# EAGLE schematic SX-150 Mk II (MIDI THT Proto E7) (EAGLE 7.4.0)
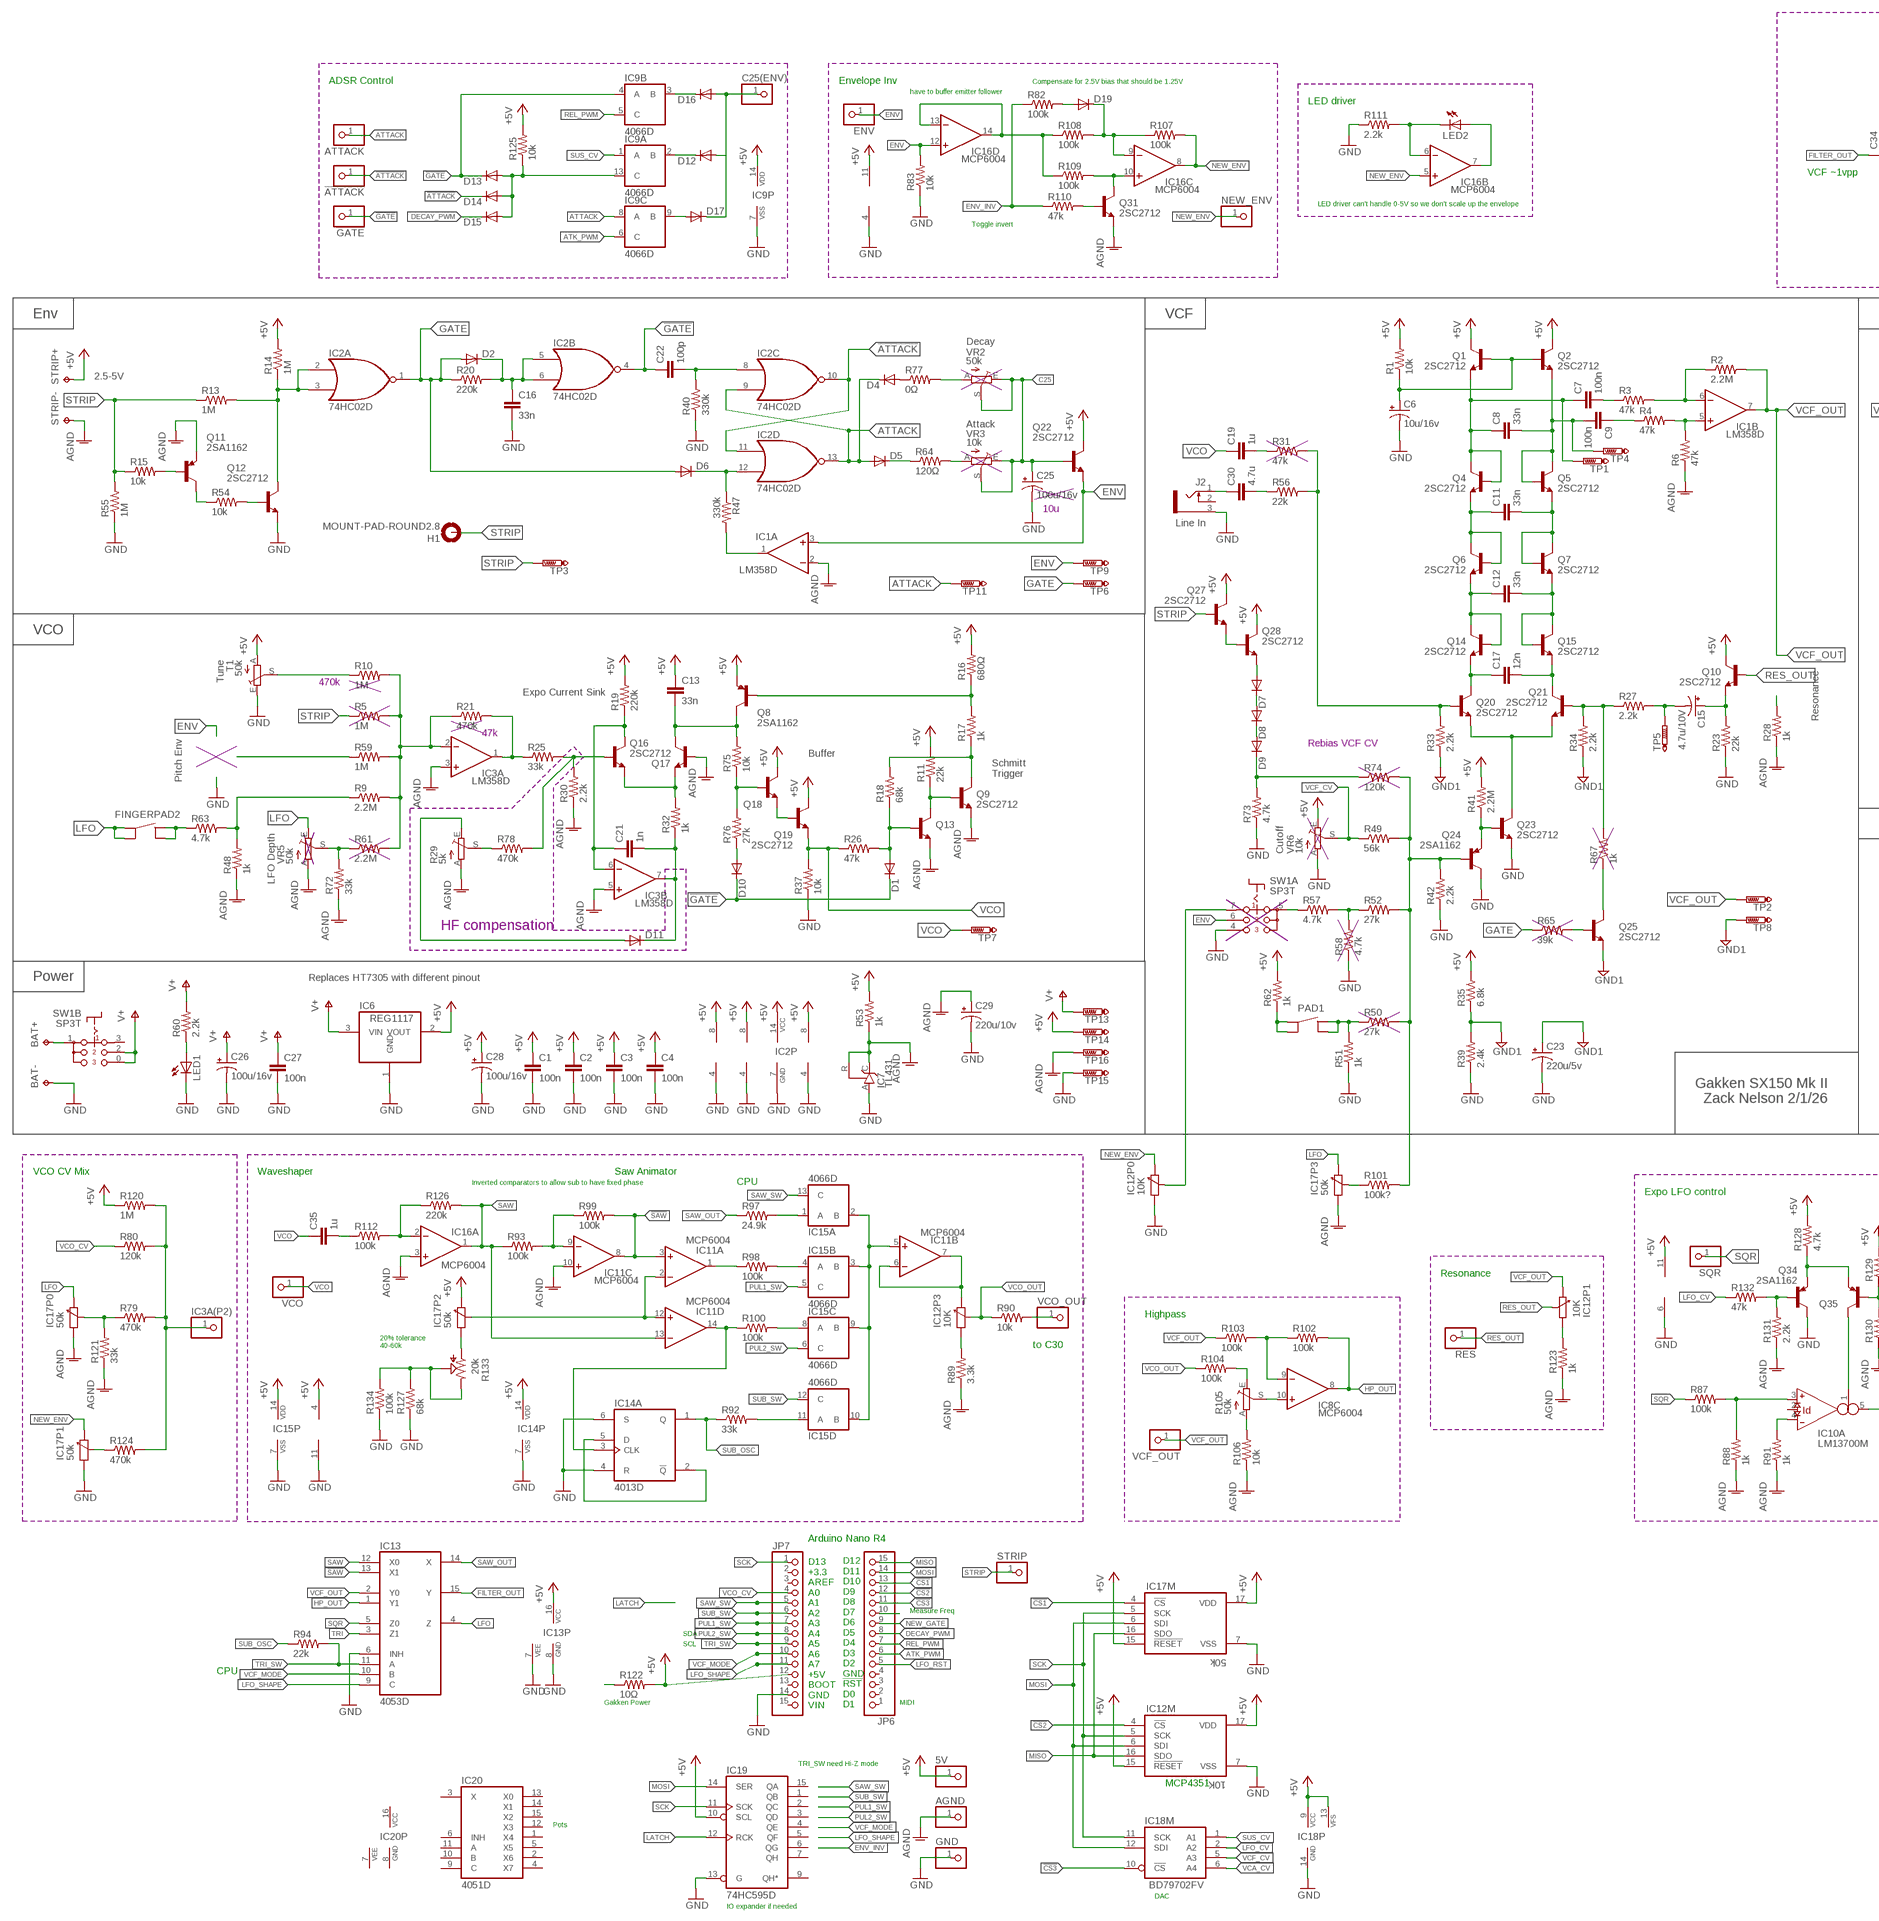
[diagram p0: schematic, sheet 1, part 1 of 2]
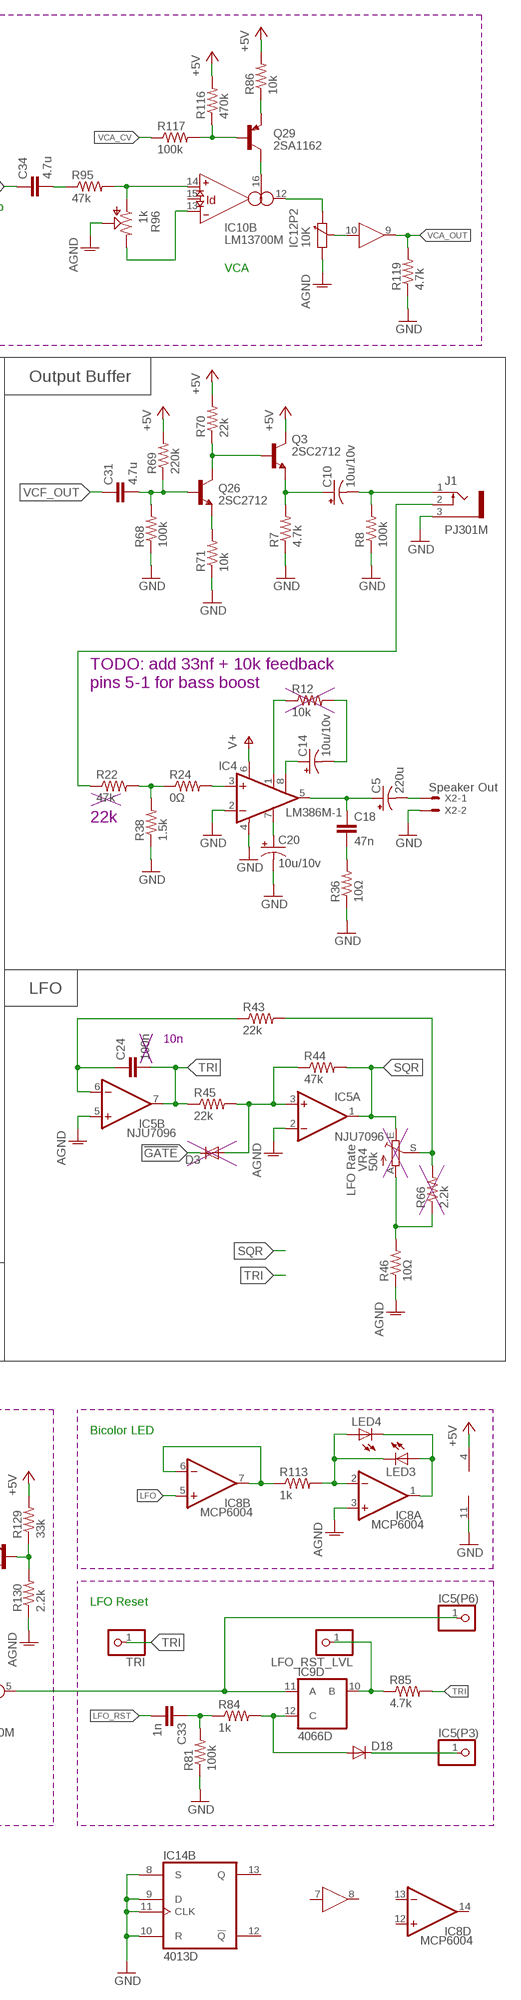
[diagram p1: schematic, sheet 1, part 2 of 2]

## Parts
5V  PINHD-1X1  [1X01]
!ATTACK  PINHD-1X1  [1X01]
!GATE  PINHD-1X1  [1X01]
AGND  PINHD-1X1  [1X01]
ATTACK  PINHD-1X1  [1X01]
BAT+  TPPAD1-13  [P1-13]
BAT-  TPPAD1-13  [P1-13]
C1  100n  C-EUC0603  [C0603]
C2  100n  C-EUC0603  [C0603]
C3  100n  C-EUC0603  [C0603]
C4  100n  C-EUC0603  [C0603]
C5  220u  CPOL-USE2.5-6  [E2,5-6]
C6  10u/16v  CPOL-USE2.5-6  [E2,5-6]
C7  100n  C-EUC0603  [C0603]
C8  33n  C-EUC0603  [C0603]
C9  100n  C-EUC0603  [C0603]
C10  10u/10v  CPOL-USE2.5-6  [E2,5-6]
C11  33n  C-EUC0603  [C0603]
C12  33n  C-EUC0603  [C0603]
C13  33n  C-EUC0603  [C0603]
C14  10u/10v  CPOL-USE2.5-6  [E2,5-6]
C15  4.7u/10V  CPOL-USE2.5-6  [E2,5-6]
C16  33n  C-EUC0603  [C0603]
C17  12n  C-EUC0603  [C0603]
C18  47n  C-EUC0603  [C0603]
C19  1u  C-EUC0603  [C0603]
C20  10u/10v  CPOL-USE2.5-6  [E2,5-6]
C21  1n  C-EUC0603  [C0603]
C22  100p  C-EUC0603  [C0603]
C23  220u/5v  CPOL-USE2.5-6  [E2,5-6]
C24  100n  C-EUC0603  [C0603]
C25  100u/16v  CPOL-USE2.5-6  [E2,5-6]
C25(ENV)  PINHD-1X1  [1X01]
C26  100u/16v  CPOL-USE2.5-6  [E2,5-6]
C27  100n  C-EUC0603  [C0603]
C28  100u/16v  CPOL-USE2.5-6  [E2,5-6]
C29  220u/10v  CPOL-USE2.5-6  [E2,5-6]
C30  4.7u  C-EUC0603  [C0603]
C31  4.7u  C-EUC0603  [C0603]
C33  1n  C-EUC0603  [C0603]
C34  4.7u  C-EUC0603  [C0603]
C35  1u  C-EUC0603  [C0603]
D1  DIODE-DO41-7.6  [DO41-7.6]
D2  DIODE-MINIMELF  [MINIMELF]
D3  DIODE-MINIMELF  [MINIMELF]
D4  DIODE-MINIMELF  [MINIMELF]
D5  DIODE-MINIMELF  [MINIMELF]
D6  DIODE-MINIMELF  [MINIMELF]
D7  DIODE-MINIMELF  [MINIMELF]
D8  DIODE-MINIMELF  [MINIMELF]
D9  DIODE-MINIMELF  [MINIMELF]
D10  DIODE-DO41-7.6  [DO41-7.6]
D11  DIODE-DO41-7.6  [DO41-7.6]
D12  DIODE-MINIMELF  [MINIMELF]
D13  DIODE-MINIMELF  [MINIMELF]
D14  DIODE-MINIMELF  [MINIMELF]
D15  DIODE-MINIMELF  [MINIMELF]
D16  DIODE-MINIMELF  [MINIMELF]
D17  DIODE-MINIMELF  [MINIMELF]
D18  DIODE-MINIMELF  [MINIMELF]
D19  DIODE-MINIMELF  [MINIMELF]
ENV  PINHD-1X1  [1X01]
FINGERPAD2  GAKKEN-PAD  [GAKKEN-PAD]
GND  PINHD-1X1  [1X01]
H1  MOUNT-PAD-ROUND2.8  [2,8-PAD]
IC1  LM358D  [SO08]
IC2  74HC02D  7402D  [SO14]
IC3  LM358D  [SO08]
IC3A(P2)  PINHD-1X1  [1X01]
IC4  LM386M-1  [SO08]
IC5  NJU7096  LM358D  [SO08]
IC5(P3)  PINHD-1X1  [1X01]
IC5(P6)  PINHD-1X1  [1X01]
IC6  REG1117  [SOT223]
IC7  TL431  TL431CLP  [TO92-CLP]
IC8  MCP6004  MCP604SL  [SO14]
IC9  4066D  [SO14]
IC10  LM13700M  [SO16]
IC11  MCP6004  MCP604SL  [SO14]
IC12  10K  MCP4351-103E/ST  [TSSOP20_MC_MCH]
IC13  4053D  [SO16]
IC14  4013D  [SO14]
IC15  4066D  [SO14]
IC16  MCP6004  MCP604SL  [SO14]
IC17  50k  MCP4351-103E/ST  [TSSOP20_MC_MCH]
IC18  BD79702FV  [TSSOP14]
IC19  74HC595D  [SO16]
IC20  4051D  [SO16]
J1  PJ301M  WQP_PJ301M-12_JACK  [JACK-3.5-NOHOLE]
J2  Line In  WQP_PJ301M-12_JACK  [JACK-3.5-NOHOLE]
JP6  PINHD-1X15  [1X15]
JP7  PINHD-1X15  [1X15]
LED1  LED3MM  [LED3MM]
LED2  LED3MM  [LED3MM]
LED3  LED3MM  [LED3MM]
LED4  LED3MM  [LED3MM]
LFO_RST_LVL  PINHD-1X1  [1X01]
NEW_ENV  PINHD-1X1  [1X01]
PAD1  GAKKEN-PAD  [GAKKEN-PAD]
Q1  2SC2712  BC808-NPN-SOT23-BEC  [SOT23-BEC]
Q2  2SC2712  BC808-NPN-SOT23-BEC  [SOT23-BEC]
Q3  2SC2712  BC808-NPN-SOT23-BEC  [SOT23-BEC]
Q4  2SC2712  BC808-NPN-SOT23-BEC  [SOT23-BEC]
Q5  2SC2712  BC808-NPN-SOT23-BEC  [SOT23-BEC]
Q6  2SC2712  BC808-NPN-SOT23-BEC  [SOT23-BEC]
Q7  2SC2712  BC808-NPN-SOT23-BEC  [SOT23-BEC]
Q8  2SA1162  BC807-16-PNP-SOT23-BEC  [SOT23-BEC]
Q9  2SC2712  BC808-NPN-SOT23-BEC  [SOT23-BEC]
Q10  2SC2712  BC808-NPN-SOT23-BEC  [SOT23-BEC]
Q11  2SA1162  BC807-16-PNP-SOT23-BEC  [SOT23-BEC]
Q12  2SC2712  BC808-NPN-SOT23-BEC  [SOT23-BEC]
Q13  2SC2712  BC808-NPN-SOT23-BEC  [SOT23-BEC]
Q14  2SC2712  BC808-NPN-SOT23-BEC  [SOT23-BEC]
Q15  2SC2712  BC808-NPN-SOT23-BEC  [SOT23-BEC]
Q16  2SC2712  BC808-NPN-SOT23-BEC  [SOT23-BEC]
Q17  2SC2712  BC808-NPN-SOT23-BEC  [SOT23-BEC]
Q18  2SC2712  BC808-NPN-SOT23-BEC  [SOT23-BEC]
Q19  2SC2712  BC808-NPN-SOT23-BEC  [SOT23-BEC]
Q20  2SC2712  BC808-NPN-SOT23-BEC  [SOT23-BEC]
Q21  2SC2712  BC808-NPN-SOT23-BEC  [SOT23-BEC]
Q22  2SC2712  BC808-NPN-SOT23-BEC  [SOT23-BEC]
Q23  2SC2712  BC808-NPN-SOT23-BEC  [SOT23-BEC]
Q24  2SA1162  BC807-16-PNP-SOT23-BEC  [SOT23-BEC]
Q25  2SC2712  BC808-NPN-SOT23-BEC  [SOT23-BEC]
Q26  2SC2712  BC808-NPN-SOT23-BEC  [SOT23-BEC]
Q27  2SC2712  BC808-NPN-SOT23-BEC  [SOT23-BEC]
Q28  2SC2712  BC808-NPN-SOT23-BEC  [SOT23-BEC]
Q29  2SA1162  BC807-16-PNP-SOT23-BEC  [SOT23-BEC]
Q31  2SC2712  BC808-NPN-SOT23-BEC  [SOT23-BEC]
Q34  2SA1162  BC807-16-PNP-SOT23-BEC  [SOT23-BEC]
Q35  2SA1162  BC807-16-PNP-SOT23-BEC  [SOT23-BEC]
R1  10k  R-US_R0603  [R0603]
R2  2.2M  R-US_R0603  [R0603]
R3  47k  R-US_R0603  [R0603]
R4  47k  R-US_R0603  [R0603]
R5  1M  R-US_R0603  [R0603]
R6  47k  R-US_R0603  [R0603]
R7  4.7k  R-US_R0603  [R0603]
R8  100k  R-US_R0603  [R0603]
R9  2.2M  R-US_R0603  [R0603]
R10  1M  R-US_R0603  [R0603]
R11  22k  R-US_R0603  [R0603]
R12  10k  R-US_R0603  [R0603]
R13  1M  R-US_R0603  [R0603]
R14  1M  R-US_R0603  [R0603]
R15  10k  R-US_R0603  [R0603]
R16  680Ω  R-US_R0603  [R0603]
R17  1k  R-US_R0603  [R0603]
R18  68k  R-US_R0603  [R0603]
R19  220k  R-US_R0603  [R0603]
R20  220k  R-US_R0603  [R0603]
R21  470k  R-US_R0603  [R0603]
R22  47k  R-US_R0603  [R0603]
R23  22k  R-US_R0603  [R0603]
R24  0Ω  R-US_R0603  [R0603]
R25  33k  R-US_R0603  [R0603]
R26  47k  R-US_R0603  [R0603]
R27  2.2k  R-US_R0603  [R0603]
R28  1k  R-US_R0603  [R0603]
R29  5k  TRIM_EU-B25P  [B25P]
R30  2.2k  R-US_R0603  [R0603]
R31  47k  R-US_R0603  [R0603]
R32  1k  R-US_R0603  [R0603]
R33  2.2k  R-US_R0603  [R0603]
R34  2.2k  R-US_R0603  [R0603]
R35  6.8k  R-US_R0603  [R0603]
R36  10Ω  R-US_R0603  [R0603]
R37  10k  R-US_R0603  [R0603]
R38  1.5k  R-US_R0603  [R0603]
R39  2.4k  R-US_R0603  [R0603]
R40  330k  R-US_R0603  [R0603]
R41  2.2M  R-US_R0603  [R0603]
R42  2.2k  R-US_R0603  [R0603]
R43  22k  R-US_R0603  [R0603]
R44  47k  R-US_R0603  [R0603]
R45  22k  R-US_R0603  [R0603]
R46  10Ω  R-US_R0603  [R0603]
R47  330k  R-US_R0603  [R0603]
R48  1k  R-US_R0603  [R0603]
R49  56k  R-US_R0603  [R0603]
R50  27k  R-US_R0603  [R0603]
R51  1k  R-US_R0603  [R0603]
R52  27k  R-US_R0603  [R0603]
R53  1k  R-US_R0603  [R0603]
R54  10k  R-US_R0603  [R0603]
R55  1M  R-US_R0603  [R0603]
R56  22k  R-US_R0603  [R0603]
R57  4.7k  R-US_R0603  [R0603]
R58  4.7k  R-US_R0603  [R0603]
R59  1M  R-US_R0603  [R0603]
R60  2.2k  R-US_R0603  [R0603]
R61  2.2M  R-US_R0603  [R0603]
R62  1k  R-US_R0603  [R0603]
R63  4.7k  R-US_R0603  [R0603]
R64  120Ω  R-US_R0603  [R0603]
R65  39k  R-US_R0603  [R0603]
R66  2.2k  R-US_R0603  [R0603]
R67  1k  R-US_R0603  [R0603]
R68  100k  R-US_R0603  [R0603]
R69  220k  R-US_R0603  [R0603]
R70  22k  R-US_R0603  [R0603]
R71  10k  R-US_R0603  [R0603]
R72  33k  R-US_R0603  [R0603]
R73  4.7k  R-US_R0603  [R0603]
R74  120k  R-US_R0603  [R0603]
R75  10k  R-US_R0603  [R0603]
R76  27k  R-US_R0603  [R0603]
R77  0Ω  R-US_R0603  [R0603]
R78  470k  R-US_R0603  [R0603]
R79  470k  R-US_R0603  [R0603]
R80  120k  R-US_R0603  [R0603]
R81  100k  R-US_R0603  [R0603]
R82  100k  R-US_R0603  [R0603]
R83  10k  R-US_R0603  [R0603]
R84  1k  R-US_R0603  [R0603]
R85  4.7k  R-US_R0603  [R0603]
R86  10k  R-US_R0603  [R0603]
R87  100k  R-US_R0603  [R0603]
R88  1k  R-US_R0603  [R0603]
R89  3.3k  R-US_R0603  [R0603]
R90  10k  R-US_R0603  [R0603]
R91  1k  R-US_R0603  [R0603]
R92  33k  R-US_R0603  [R0603]
R93  100k  R-US_R0603  [R0603]
R94  22k  R-US_R0603  [R0603]
R95  47k  R-US_R0603  [R0603]
R96  1k  TRIM_US-B25P  [B25P]
R97  24.9k  R-US_R0603  [R0603]
R98  100k  R-US_R0603  [R0603]
R99  100k  R-US_R0603  [R0603]
R100  100k  R-US_R0603  [R0603]
R101  100k?  R-US_R0603  [R0603]
R102  100k  R-US_R0603  [R0603]
R103  100k  R-US_R0603  [R0603]
R104  100k  R-US_R0603  [R0603]
R105  50k  TRIM_EU-B25P  [B25P]
R106  10k  R-US_R0603  [R0603]
R107  100k  R-US_R0603  [R0603]
R108  100k  R-US_R0603  [R0603]
R109  100k  R-US_R0603  [R0603]
R110  47k  R-US_R0603  [R0603]
R111  2.2k  R-US_R0603  [R0603]
R112  100k  R-US_R0603  [R0603]
R113  1k  R-US_R0603  [R0603]
R116  470k  R-US_R0603  [R0603]
R117  100k  R-US_R0603  [R0603]
R119  4.7k  R-US_R0603  [R0603]
R120  1M  R-US_R0603  [R0603]
R121  33k  R-US_R0603  [R0603]
R122  10Ω  R-US_R0603  [R0603]
R123  1k  R-US_R0603  [R0603]
R124  470k  R-US_R0603  [R0603]
R125  10k  R-US_R0603  [R0603]
R126  220k  R-US_R0603  [R0603]
R127  68k  R-US_R0603  [R0603]
R128  4.7k  R-US_R0603  [R0603]
R129  33k  R-US_R0603  [R0603]
R130  2.2k  R-US_R0603  [R0603]
R131  2.2k  R-US_R0603  [R0603]
R132  47k  R-US_R0603  [R0603]
R133  20k  TRIM_US-B25P  [B25P]
R134  100k  R-US_R0603  [R0603]
RES  PINHD-1X1  [1X01]
SQR  PINHD-1X1  [1X01]
STRIP  PINHD-1X1  [1X01]
STRIP+  TPB2,54  [B2,54]
STRIP-  TPB2,54  [B2,54]
SW1  SP3T  [SP3T]
T1  50k  TRIM_EU-CA9V  [CA9V]
TP1  PTR1B1,27  [B1,27]
TP2  PTR1B1,27  [B1,27]
TP3  PTR1B1,27  [B1,27]
TP4  PTR1B1,27  [B1,27]
TP5  PTR1B1,27  [B1,27]
TP6  PTR1B1,27  [B1,27]
TP7  PTR1B1,27  [B1,27]
TP8  PTR1B1,27  [B1,27]
TP9  PTR1B1,27  [B1,27]
TP11  PTR1B1,27  [B1,27]
TP13  PTR1B1,27  [B1,27]
TP14  PTR1B1,27  [B1,27]
TP15  PTR1B1,27  [B1,27]
TP16  PTR1B1,27  [B1,27]
TRI  PINHD-1X1  [1X01]
VCF_OUT  PINHD-1X1  [1X01]
VCO  PINHD-1X1  [1X01]
VCO_OUT  PINHD-1X1  [1X01]
VR2  50k  TRIM_EU-CA9V  [CA9V]
VR3  10k  TRIM_EU-CA9V  [CA9V]
VR4  50k  TRIM_EU-CA9V  [CA9V]
VR5  50k  TRIM_EU-CA9V  [CA9V]
VR6  10k  TRIM_EU-CA9V  [CA9V]
X2  Speaker Out  22-23-2021  [22-23-2021]

## Nets
!ATTACK: !ATTACK.1 D14.C IC2.10(C:O) IC2.11(D:I0)
!CS1 [power]: IC17.4(M:!CS) JP6.13
!CS2 [power]: IC12.4(M:!CS) JP6.12
!CS3: IC18.10(M:!CS) JP6.11
!GATE: !GATE.1 C22.1 D1.C D3.C D10.C D13.C IC2.4(B:O) IC9.4(B:A)
!SAW: IC11.3(A:+IN) IC11.8(C:OUT) IC13.13(X1) R99.2
+5V [power]: 5V.1 C1.1 C2.1 C3.1 C4.1 C13.1 C28.+ IC1.8(P:V+) IC2.14(P:VCC) IC3.8(P:V+) IC5.8(P:V+) IC6.2(VOUT) IC8.4(P:V+) IC9.14(P:VDD) IC10.11(V+) IC11.4(P:V+) IC12.15(M:!RESET) IC12.17(M:VDD) IC13.16(VCC) IC14.14(P:VDD) IC15.14(P:VDD) IC16.11(P:V-) IC17.15(M:!RESET) IC17.17(M:VDD) IC17.18(P2:B) IC18.9(P:VCC) IC18.13(P:VFS) IC19.10(SCL) JP7.12 Q1.C Q2.C Q3.C Q8.E Q10.C Q18.C Q19.C Q22.C Q27.C Q28.C R1.2 R11.2 R14.2 R16.2 R19.2 R35.2 R41.2 R53.2 R62.2 R69.2 R70.2 R86.2 R116.2 R120.1 R122.2 R125.2 R128.2 R129.2 STRIP+.TP T1.A TP14.TP VR6.E
AGND [power]: AGND.1 C29.+ IC1.2(A:-IN) IC3.3(A:+IN) IC3.5(B:+IN) IC5.2(A:-IN) IC5.5(B:+IN) IC7.C IC7.R IC8.3(A:+IN) IC11.10(C:+IN) IC12.20(P2:A) IC16.3(A:+IN) IC17.1(P3:A) IC17.11(P0:A) Q9.E Q11.E Q13.E Q17.B Q31.E R6.1 R28.1 R29.A R30.1 R46.1 R48.1 R53.1 R72.1 R88.1 R89.1 R91.1 R96.S R106.1 R121.1 R123.1 R130.1 R131.1 STRIP-.TP TP16.TP VR5.A
ATK_PWM: IC9.6(C:C) JP6.6
ATTACK: ATTACK.1 D4.C D5.A IC2.9(C:I1) IC2.13(D:O) IC9.8(C:A) TP11.TP
C25: C25(ENV).1 C25.+ D12.A D16.A D17.C Q22.B VR2.E VR2.S VR3.E VR3.S
DECAY_PWM: D15.C JP6.8
ENV: ENV.1 IC1.3(A:+IN) IC16.12(D:+IN) Q22.E R83.2 SW1.6(A:T2) TP9.TP
ENV_INV: R82.1 R110.1
FILTER_OUT: C34.1 IC13.15(Y)
GATE: D2.A D6.A IC2.1(A:O) R20.1 R65.1 TP6.TP
GND: BAT-.TP C1.2 C2.2 C3.2 C4.2 C6.- C16.2 C20.- C23.- C25.- C26.- C27.2 C28.- C29.- GND.1 IC1.4(P:V-) IC2.7(P:GND) IC3.4(P:V-) IC4.2(-IN) IC4.4(GND) IC5.4(P:V-) IC6.1(GND) IC7.A IC8.11(P:V-) IC9.7(P:VSS) IC10.6(V-) IC11.11(P:V-) IC12.7(M:VSS) IC12.11(P0:A) IC13.6(INH) IC13.7(VEE) IC13.8(GND) IC14.4(A:R) IC14.6(A:S) IC14.7(P:VSS) IC14.8(B:S) IC14.9(B:D) IC14.10(B:R) IC14.11(B:CLK) IC15.7(P:VSS) IC16.4(P:V+) IC17.7(M:VSS) IC17.10(P1:A) IC18.14(P:GND) IC19.13(G) J1.3 J2.3 JP7.14 LED1.K(C) Q12.E Q23.E Q24.C Q34.C R7.1 R8.1 R23.1 R36.1 R37.1 R38.1 R39.1 R40.1 R42.1 R51.1 R55.1 R58.1 R68.1 R71.1 R73.1 R81.1 R83.1 R111.1 R119.1 R127.1 R134.1 SW1.4(A:T3) T1.E TP15.TP VR6.A X2.2
GND1: C23.+ Q25.E R33.1 R34.1 R35.1 R39.2 TP8.TP
HP_OUT: IC8.8(C:OUT) IC13.1(Y1) R102.2
LATCH: IC19.12(RCK)
LFO: FINGERPAD2.A0 FINGERPAD2.A1 IC8.5(B:+IN) IC13.4(Z) IC17.3(P3:B) IC17.13(P0:B) VR5.E
LFO_CV: IC18.2(M:A2) R132.1
LFO_RST: C33.2 JP6.5
LFO_SHAPE: IC13.9(C) JP7.11
MISO [power]: IC12.16(M:SDO) IC17.16(M:SDO) JP6.15
MOSI [power]: IC12.6(M:SDI) IC17.6(M:SDI) IC18.12(M:SDI) IC19.14(SER) JP6.14
N$1: IC1.1(A:OUT) R47.2
N$2: D5.C R64.1
N$3: IC2.2(A:I0) IC2.3(A:I1) Q12.C R13.2 R14.1
N$4: D12.C IC9.2(A:B)
N$5: JP6.10
N$6: C22.2 IC2.8(C:I0) R40.2
N$7: Q12.B R54.2
N$8: C16.1 D2.C IC2.5(B:I0) IC2.6(B:I1) R20.2
N$9: D6.C IC2.12(D:I1) R47.1
N$10: D4.A R77.1
N$11: D17.A IC9.9(C:B)
N$12: R64.2 VR3.A
N$13: D19.A R82.2
N$14: Q11.C R54.1
N$15: Q11.B R15.2
N$16: R61.1 R72.2 VR5.S
N$17: IC5(P6).1 IC9.11(D:A) IC10.5(A:OUT)
N$18: IC3.2(A:-IN) R5.2 R9.2 R10.2 R21.1 R59.2 R61.2
N$19: D18.C IC5(P3).1
N$20: R46.2 R66.1 VR4.A
N$21: R43.2 R66.2 VR4.S
N$22: IC3.1(A:OUT) R21.2 R25.1
N$23: Q16.B R25.2 R30.2 R78.2
N$24: R59.1
N$25: R9.1 R48.2 R63.2
N$26: R10.1 T1.S
N$27: C13.2 Q8.C Q17.C R75.2
N$28: Q8.B R16.1 R17.2
N$29: C21.2 D11.C IC3.7(B:OUT) R32.1
N$30: Q16.E Q17.E R32.2
N$31: C21.1 IC3.6(B:-IN) Q16.C R19.1
N$32: Q9.C R17.1 R18.2
N$33: Q18.B R75.1 R76.2
N$34: Q18.E Q19.B
N$35: BAT+.TP SW1.1(B:P1)
N$36: Q9.B Q13.C R11.1
N$37: D1.A Q13.B R18.1 R26.2
N$38: D10.A R76.1
N$39: C7.1 C8.1 Q1.E Q4.B Q4.C TP1.TP
N$40: C8.2 C9.2 Q2.E Q5.B Q5.C TP4.TP
N$41: C6.+ Q1.B Q2.B R1.1
N$42: Q20.E Q21.E Q23.C
N$43: C11.1 Q4.E Q6.B Q6.C
N$44: C11.2 Q5.E Q7.B Q7.C
N$45: Q20.B R31.2 R33.2 R56.2
N$46: C12.1 Q6.E Q14.B Q14.C
N$47: C12.2 Q7.E Q15.B Q15.C
N$48: C17.1 Q14.E Q20.C
N$49: C17.2 Q15.E Q21.C
N$50: Q21.B R27.1 R34.2 R67.2
N$51: C7.2 R3.1
N$52: C9.1 R4.1
N$53: IC1.6(B:-IN) R2.1 R3.2
N$54: IC1.5(B:+IN) R4.2 R6.2
N$55: Q23.B Q24.E R41.1
N$56: Q25.C R67.1
N$57: Q25.B R65.2
N$58: C15.- R27.2 TP5.TP
N$59: C15.+ Q10.E R23.2
N$60: IC17.9(P1:W) R124.1
N$61: R28.2
N$62: Q29.E R86.1
N$63: Q24.B R42.2 R49.2 R50.2 R52.2 R74.2 R101.2
N$64: R57.1 SW1.5(A:P1)
N$65: C35.2 R112.1
N$66: R52.1 R57.2 R58.2
N$67: PAD1.B0 PAD1.B1 R50.1 R51.2
N$68: C19.2 R31.1
N$69: C30.2 R56.1
N$70: C30.1 J2.1
N$71: C31.2 Q26.B R68.2 R69.1
N$72: Q3.B Q26.C R70.1
N$73: Q26.E R71.2
N$74: C10.+ Q3.E R7.2
N$75: C10.- J1.1 R8.2
N$76: Q27.E Q28.B
N$77: PAD1.A0 PAD1.A1 R62.1
N$78: D7.A Q28.E
N$79: D7.C D8.A
N$80: D8.C D9.A
N$81: D9.C R73.2 R74.1
N$82: FINGERPAD2.B0 FINGERPAD2.B1 R63.1
N$83: C20.+ IC4.7(BYPASS)
N$84: C14.+ IC4.8(GAIN)
N$85: IC4.1(GAIN) R12.1
N$86: C14.- R12.2
N$87: C5.+ C18.1 IC4.5(OUT)
N$88: IC4.3(+IN) R24.2
N$89: C5.- X2.1
N$90: J1.2 R22.1
N$91: C18.2 R36.2
N$92: D11.A R29.E
N$93: R22.2 R24.1 R38.2
N$94: LED1.A R60.1
N$95: IC10.16(B:IABC) Q29.C
N$96: R29.S R78.1
N$97: D13.A D14.A D15.A IC9.13(A:C) R125.1
N$98: C24.1 IC5.6(B:-IN) R43.1
N$100: D19.C IC16.9(C:-IN) R107.1 R108.2
N$101: D16.C IC9.3(B:B)
N$102: R77.2 VR2.A
N$103: D18.A IC9.12(D:C) R84.2
N$105: IC11.1(A:OUT) R98.1
N$106: IC8.10(C:+IN) R105.S
N$107: IC16.13(D:-IN) IC16.14(D:OUT) R108.1 R109.1
N$108: C33.1 R81.2 R84.1
N$109: IC14.2(A:!Q) IC14.5(A:D)
N$110: IC12.12(P0:W) SW1.7(A:T1)
N$111: IC10.3(A:+IN) R87.2 R88.2
N$112: IC10.4(A:-IN) R91.2
N$113: IC15.1(A:A) R97.2
N$114: IC15.4(B:A) R98.2
N$115: IC15.8(C:A) R100.2
N$116: IC10.14(B:+IN) R95.2 R96.A
N$117: IC12.1(P3:A) R89.2
N$118: IC9.10(D:B) LFO_RST_LVL.1 R85.1
N$119: IC11.5(B:+IN) IC15.2(A:B) IC15.3(B:B) IC15.9(C:B) IC15.10(D:B)
N$120: IC10.13(B:-IN) R96.E
N$121: IC15.11(D:A) R92.2
N$122: IC11.6(B:-IN) IC11.7(B:OUT) IC12.3(P3:B)
N$123: IC11.9(C:-IN) R93.2 R99.1
N$124: IC11.14(D:OUT) IC14.3(A:CLK) R100.1
N$125: C34.2 R95.1
N$126: IC8.9(C:-IN) R102.1 R103.2
N$127: Q29.B R116.1 R117.2
N$128: R104.2 R105.E
N$129: IC10.10(IN) IC12.19(P2:W)
N$130: R105.A R106.2
N$131: IC16.10(C:+IN) Q31.C R109.2
N$132: IC17.20(P2:A) R133.A
N$133: Q31.B R110.2
N$134: IC8.1(A:OUT) LED3.A LED4.K(C)
N$135: R127.2 R133.E R133.S R134.2
N$137: IC16.7(B:OUT) LED2.A
N$138: IC16.6(B:-IN) LED2.K(C) R111.2
N$139: IC8.2(A:-IN) LED3.K(C) LED4.A R113.2
N$140: IC8.6(B:-IN) IC8.7(B:OUT) R113.1
N$141: D3.A IC5.3(A:+IN) R44.1 R45.2
N$142: IC17.2(P3:W) R101.1
N$143 [power]: IC17.12(P0:W) R79.1 R121.2
N$144 [power]: IC3A(P2).1 R79.2 R80.2 R120.2 R124.2
N$145 [power]: IC10.12(B:OUT) IC12.18(P2:B)
N$150 [power]: R122.1
N$151: IC12.10(P1:A) R123.2
N$152: IC16.2(A:-IN) R112.2 R126.1
N$153: R90.2 VCO_OUT.1
N$155: Q34.E Q35.E R128.1
N$156: Q35.B R129.1 R130.2
N$157: Q34.B R131.2 R132.2
N$158: IC10.1(A:IABC) Q35.C
NEW_ENV: IC12.13(P0:B) IC16.5(B:+IN) IC16.8(C:OUT) IC17.8(P1:B) NEW_ENV.1 R107.2
NEW_GATE: JP6.9
PUL1_SW: IC15.5(B:C) JP7.7
PUL2_SW: IC15.6(C:C) JP7.8
REL_PWM: IC9.5(B:C) JP6.7
RES_OUT: IC12.9(P1:W) Q10.B RES.1
SAW: IC11.13(D:-IN) IC13.12(X0) IC16.1(A:OUT) R93.1 R126.2
SAW_CV: IC11.2(A:-IN) IC11.12(D:+IN) IC17.19(P2:W)
SAW_OUT: IC13.14(X) R97.1
SAW_SW: IC15.13(A:C) JP7.5
SCK [power]: IC12.5(M:SCK) IC17.5(M:SCK) IC18.11(M:SCK) IC19.11(SCK) JP7.1
SQR: IC5.1(A:OUT) IC13.5(Z0) R44.2 R87.1 SQR.1 VR4.E
STRIP: H1.B2,8(MOUNT) Q27.B R5.1 R13.1 R15.1 R55.2 STRIP.1 TP3.TP
SUB_OSC: IC14.1(A:Q) R92.1 R94.1
SUB_SW: IC15.12(D:C) JP7.6
SUS_CV: IC9.1(A:A) IC18.1(M:A1)
TRI: C24.2 IC5.7(B:OUT) IC13.3(Z1) R45.1 R85.2 TRI.1
TRI_SW: IC13.11(A) JP7.9 R94.2
V+: C26.+ C27.1 IC4.6(VS) IC6.3(VIN) R60.2 SW1.0(B:T3) SW1.2(B:T2) TP13.TP
VCA_CV: IC18.6(M:A4) R117.1
VCA_OUT [power]: IC10.9(OUT) R119.2
VCF_CV: IC18.5(M:A3) R49.1 VR6.S
VCF_MODE: IC13.10(B) JP7.10
VCF_OUT: C31.1 IC1.7(B:OUT) IC12.8(P1:B) IC13.2(Y0) R2.2 R103.1 TP2.TP VCF_OUT.1
VCO: C19.1 C35.1 Q19.E R26.1 R37.2 TP7.TP VCO.1
VCO_CV: JP7.4 R80.1
VCO_OUT: IC12.2(P3:W) R90.1 R104.1
Unconnected: IC8.12(D:+IN) IC8.13(D:-IN) IC8.14(D:OUT) IC10.2(A:ID) IC10.7(IN) IC10.8(OUT) IC10.15(B:ID) IC14.12(B:!Q) IC14.13(B:Q) IC19.1(QB) IC19.2(QC) IC19.3(QD) IC19.4(QE) IC19.5(QF) IC19.6(QG) IC19.7(QH) IC19.9(QH*) IC19.15(QA) IC20.1(X4) IC20.2(X6) IC20.3(X) IC20.4(X7) IC20.5(X5) IC20.6(INH) IC20.9(C) IC20.10(B) IC20.11(A) IC20.12(X3) IC20.13(X0) IC20.14(X1) IC20.15(X2) J2.2 JP6.1 JP6.2 JP6.3 JP6.4 JP7.2 JP7.3 JP7.13 JP7.15 SW1.3(B:T1)

## Notes on the sheet
- ADSR Control | Envelope Inv | Compensate for 2.5V bias that should be 1.25V
- have to buffer emitter follower
- LED driver
- VCF ~1vpp
- LED driver can't handle 0-5V so we don't scale up the envelope
- Toggle invert | VCA
- Env | VCF | Output Buffer
- Decay
- 2.5-5V
- Attack
- 10u
- TODO: add 33nf + 10k feedback
  pins 5-1 for bass boost
- VCO
- Tune
- 470k | 22k
- Expo Current Sink
- Resonance
- 47k
- Rebias VCF CV
- Buffer
- Schmitt
  Trigger
- Pitch Env
- LFO
- Cutoff
- 10n
- LFO Depth
- HF compensation
- Power | Replaces HT7305 with different pinout
- LFO Rate
- Gakken SX150 Mk II
  Zack Nelson 2/1/26
- VCO CV Mix | Waveshaper | Saw Animator
- Inverted comparators to allow sub to have fixed phase | CPU
- Expo LFO control | Bicolor LED
- Resonance
- Highpass
- LFO Reset
- 20% tolerance
  40-60k
- to C30
- Arduino Nano R4
- Measure Freq
- SDA
- SCL
- CPU
- Gakken Power | MIDI
- D12
  D11
  D10
  D9
  D8
  D7
  D6
  D5
  D4
  D3
  D2
  GND
  !RST
  D0
  D1
- D13
  +3.3
  AREF
  A0
  A1
  A2
  A3
  A4
  A5
  A6
  A7
  +5V
  BOOT
  GND
  VIN
- TRI_SW need Hi-Z mode
- MCP4351
- Pots
- DAC
- IO expander if needed

## Power pins joined to a net without a drawn wire
GND: IC19.8(GND) IC20.8(GND)
VCC: IC19.16(VCC) IC20.16(VCC)
VEE: IC20.7(VEE)

## Library data of the parts
5V !ATTACK !GATE AGND ATTACK C25(ENV) ENV GND IC3A(P2) IC5(P3) IC5(P6) LFO_RST_LVL NEW_ENV RES SQR STRIP TRI VCF_OUT VCO VCO_OUT = pinhead:PINHD-1X1: PIN HEADER
BAT+ BAT- STRIP+ STRIP- = testpad:TP: Test pad
C1-C4 C7-C9 C11-C13 C16-C19 C21 C22 C24 C27 C30 C31 C33-C35 = rcl:C-EU: CAPACITOR, European symbol; SPICEPREFIX: C
C5 C6 C10 C14 C15 C20 C23 C25 C26 C28 C29 = rcl:CPOL-US: POLARIZED CAPACITOR, American symbol; SPICEPREFIX: C
D1-D19 = diode:DIODE-: DIODE
FINGERPAD2 PAD1 = dom-key:GAKKEN-PAD
H1 = holes:MOUNT-PAD-ROUND: MOUNTING PAD, round
IC1 IC3 IC5 = linear:LM358: OP AMP also LM158; LM258; LM2904 Source: http://cache.national.com/ds/LM/LM158.pdf
IC2 = 74xx-us:74*02: Quad 2-input NOR gate
IC4 = linear (TSSOP):LM386?-*: Low Voltage Audio Power Amplifier Source: http://cache.national.com/ds/LM/LM386.pdf
IC6 = burr-brown:REG1117: 800mA and 1A Low Dropout (LDO) Positive Regulator 1.8V, 2.5V, 2.85V, 3.3V, 5V, and Adj; MPN: REG1117; OC_FARNELL: 1097566; OC_NEWARK: 14P6981
IC7 = v-reg:TL431CLP: VOLTAGE REGULATOR
IC8 IC11 IC16 = linear@1:MCP604: Quad Op Amp 2.7V to 6.0V Single Supply CMOS Source: http://ww1.microchip.com/downloads/en/DeviceDoc/21314g.pdf
IC9 IC15 = 40xx (TSSOP):4066: Quad bilateral ANALOG SWITCH
IC10 = synthdiy:LM13700: National Dual OTA with buffers.
IC12 IC17 = microchip-digital-potentiometer:MCP4351-103E/ST; COPYRIGHT: Copyright (C) 2026 Ultra Librarian. All rights reserved.; MANUFACTURER_NAME: Microchip; MANUFACTURER_PART_NUMBER: MCP4351-103E/ST
IC13 = 40xx:4053: Triple 2-channel ANALOG MULTIPLEXER
IC14 = 40xx:4013: Dual D FLIP FLOP, set/reset
IC18 = microchip-digital-potentiometer:BD79702FV
IC19 = 74xx-eu (TSSOP):74*595: 8-bit SHIFT REGISTER, output latch
IC20 = 40xx (TSSOP):4051: 8-channel ANALOG MULTIPLEXER
J1 J2 = thonkiconn_eagle_v5 (2):WQP_PJ301M-12_JACK: 3.5mm Vertical Jack from Thonk.co.uk
JP6 JP7 = pinhead:PINHD-1X15: PIN HEADER
LED1-LED4 = led:LED: LED OSRAM: - CHIPLED LG R971, LG N971, LY N971, LG Q971, LY Q971, LO R971, LY R971 LH N974, LH R974 LS Q976, LO Q976, LY Q976 LO Q996 - Hyper CHIPLED LW Q18S LB Q993, LB Q99A, LB R99A - SideLED LS A670, LO A670, LY A670, LG A670, LP A670 LB A673, LV A673, LT A673, LW A673 LH A674 LY A675 LS A676, LA A676, LO A676, LY A676, LW A676 LS A679, LY A679, LG A679 - Hyper Micro SIDELED® LS Y876, LA Y876, LO Y876, LY Y876 LT Y87S - SmartLED LW L88C, LW L88S LB L89C, LB L89S, LG L890 LS L89K, LO L89K, LY L89K LS L896, LA L896, LO L896, LY L896 - TOPLED LS T670, LO T670, LY T670, LG T670, LP T670 LSG T670, LSP T670, LSY T670, LOP T670, LYG T670 LG T671, LOG T671, LSG T671 LB T673, LV T673, LT T673, LW T673 LH T674 LS T676, LA T676, LO T676, LY T676, LB T676, LH T676, LSB T676, LW T676 LB T67C, LV T67C, LT T67C, LS T67K, LO T67K, LY T67K, LW E67C LS E67B, LA E67B, LO E67B, LY E67B, LB E67C, LV E67C, LT E67C LW T67C LS T679, LY T679, LG T679 LS T770, LO T770, LY T770, LG T770, LP T770 LB T773, LV T773, LT T773, LW T773 LH T774 LS E675, LA E675, LY E675, LS T675 LS T776, LA T776, LO T776, LY T776, LB T776 LHGB T686 LT T68C, LB T68C - Hyper Mini TOPLED® LB M676 - Mini TOPLED Santana® LG M470 LS M47K, LO M47K, LY M47K Source: http://www.osram.convergy.de LUXEON: - LUMILED® LXK2-PW12-R00, LXK2-PW12-S00, LXK2-PW14-U00, LXK2-PW14-V00 LXK2-PM12-R00, LXK2-PM12-S00, LXK2-PM14-U00 LXK2-PE12-Q00, LXK2-PE12-R00, LXK2-PE12-S00, LXK2-PE14-T00, LXK2-PE14-U00 LXK2-PB12-K00, LXK2-PB12-L00, LXK2-PB12-M00, LXK2-PB14-N00, LXK2-PB14-P00, LXK2-PB14-Q00 LXK2-PR12-L00, LXK2-PR12-M00, LXK2-PR14-Q00, LXK2-PR14-R00 LXK2-PD12-Q00, LXK2-PD12-R00, LXK2-PD12-S00 LXK2-PH12-R00, LXK2-PH12-S00 LXK2-PL12-P00, LXK2-PL12-Q00, LXK2-PL12-R00 Source: www.luxeon.com KINGBRIGHT: KA-3528ASYC Source: www.kingbright.com
Q1-Q7 Q9 Q10 Q12-Q23 Q25-Q28 Q31 = transistor:*-NPN-: NPN Transistror BF959 corrected 2008.03.06
Q8 Q11 Q24 Q29 Q34 Q35 = transistor:*-PNP-: PNP Transistror
R1-R28 R30-R95 R97-R104 R106-R113 R116 R117 R119-R132 R134 = rcl:R-US_: RESISTOR, American symbol; SPICEPREFIX: R
R29 R105 = pot@1:TRIM_EU-: POTENTIOMETER
R96 R133 = pot2:TRIM_US-: POTENTIOMETER
SW1 = switch:SP3T
T1 VR2-VR6 = pot:TRIM_EU-: POTENTIOMETER
TP1-TP9 TP11 TP13-TP16 = testpad:PTR1: TEST PIN
X2 = con-molex:22-23-2021: .100" (2.54mm) Center Header - 2 Pin; MF: MOLEX; MPN: 22-23-2021; OC_FARNELL: 1462926; OC_NEWARK: 25C3832

## Net classes
1 power: width 0.508 mm